# Altium project esp32_controller.PrjPCB
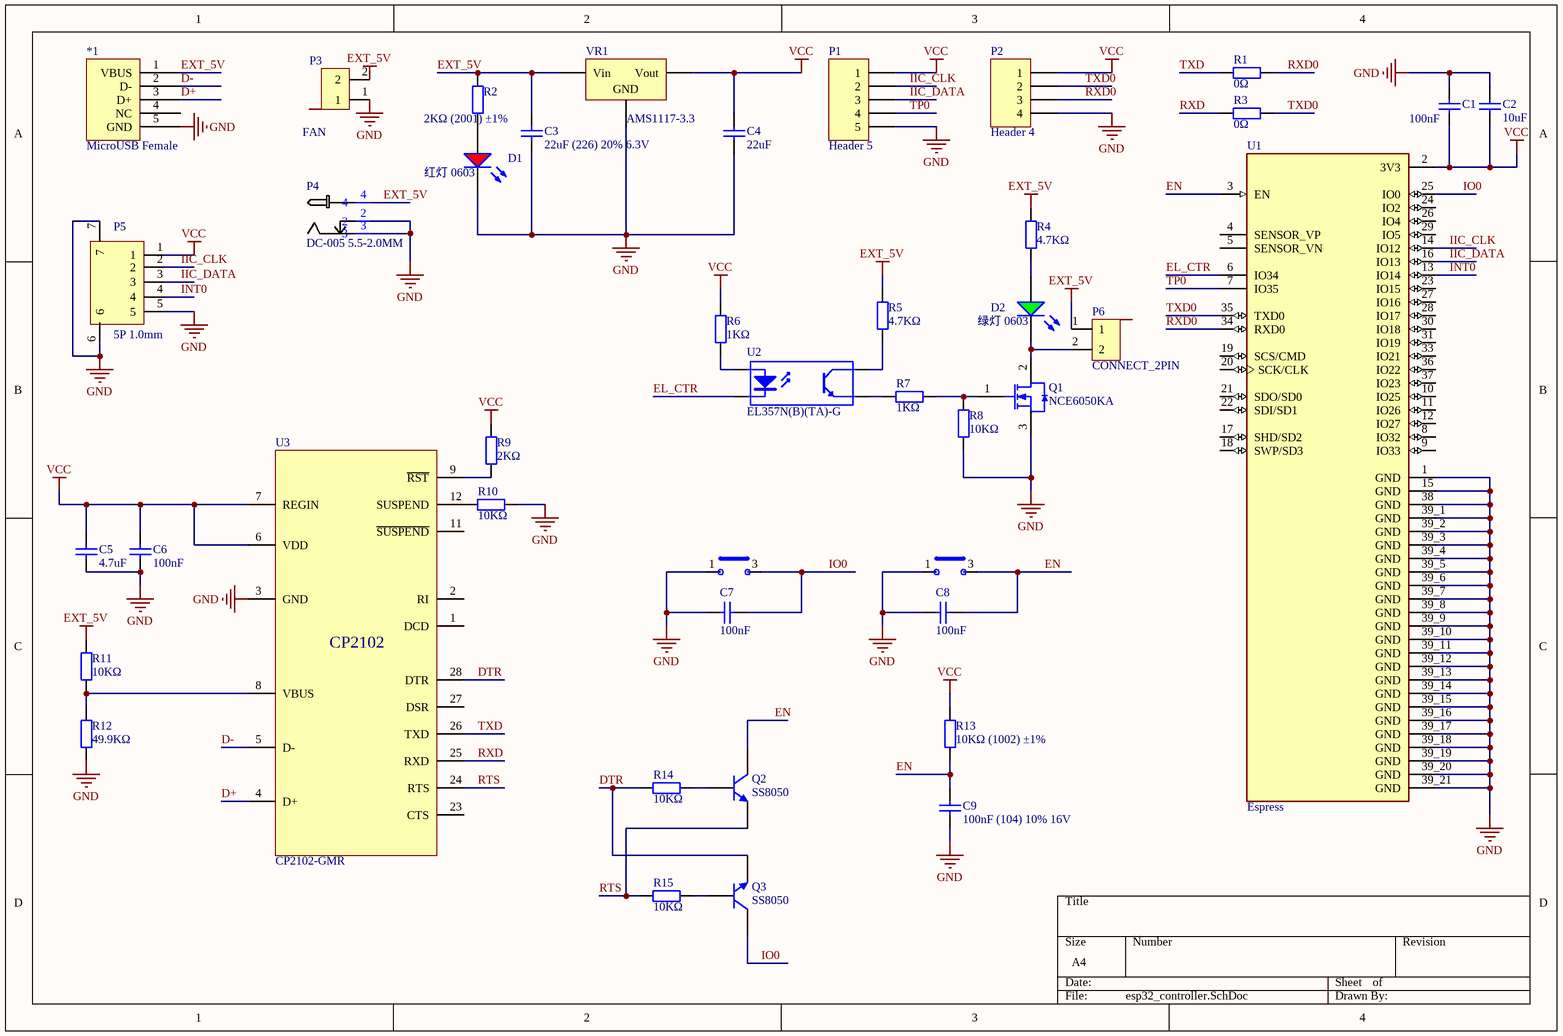
[diagram p0: esp32_controller.SchDoc]
1 sheet, 42 parts. Net scope: global (net labels, ports and power ports of the same name join across sheets).
Board file: esp32_controller.PcbDoc

## Sheet esp32_controller.SchDoc
size A4

### Parts
*1  MicroUSB Female  [MicroUSB Female]
C1  100nF  [0402_C]
C2  10uF  [0603_C]
C3  22uF (226) 20% 6.3V  [0603_C]
C4  22uF  [0603_C]
C5  4.7uF  [0603_C]
C6  100nF  [0603_C]
C7  100nF  [0402_C]
C8  100nF  [0402_C]
C9  100nF (104) 10% 16V  [0402_C]
D1  红灯 0603  [0603_LED_S1]
D2  绿灯 0603  [0603_LED_S1]
P1  Header 5  [HDR1X5]
P2  Header 4  [HDR1X4]
P3  FAN  [CONNECT_2PIN]
P4  DC-005 5.5-2.0MM  [DC-005]
P5  5P 1.0mm  [FPC 1.00MM CONNECTOR SMT]
P6  CONNECT_2PIN  [CONNECT_2PIN]
Q1  NCE6050KA  [TO-252-2]
Q2  SS8050  [SOT-23(SOT-23-3)]
Q3  SS8050  [SOT-23(SOT-23-3)]
R1  0Ω  [0402_R]
R2  2KΩ (2001) ±1%  [0402_R]
R3  0Ω  [0402_R]
R4  4.7KΩ  [0805_R]
R5  4.7KΩ  [0805_R]
R6  1KΩ  [0402_R]
R7  1KΩ  [0805_R]
R8  10KΩ  [0805_R]
R9  2KΩ  [0402_R]
R10  10KΩ  [0402_R]
R11  10KΩ  [0402_R]
R12  49.9KΩ  [0402_R]
R13  10KΩ (1002) ±1%  [0402_R]
R14  10KΩ  [0402_R]
R15  10KΩ  [0402_R]
S1  Tactile Switch 轻触开关  [button]  (value not drawn)
S2  Tactile Switch 轻触开关  [button]  (value not drawn)
U1  Espress  [MODULE_ESP32-WROOM-32D]
U2  EL357N(B)(TA)-G  [SOP-4_P2.54]
U3  CP2102-GMR  [QFN-28_5x5x05P]
VR1  AMS1117-3.3  [SOT-223]

### Nets
EXT_5V: *1.1(VBUS) C3.2 P3.2 P4.4 P6.1 R2.2 R4.2 R5.2 R11.2 VR1.3(Vin)
GND: *1.5(GND) C1.2 C2.2 C3.1 C4.1 C5.1 C6.1 C7.1 C8.1 C9.1 D1.K P1.5 P2.4 P3.1 P4.2 P4.3 P5.5 P5.6 P5.7 Q1.3(S) R8.1 R10.2 R12.1 S1.1 S2.1 U1.1(GND) U1.15(GND) U1.38(GND) U1.39_1(GND) U1.39_2(GND) U1.39_3(GND) U1.39_4(GND) U1.39_5(GND) U1.39_6(GND) U1.39_7(GND) U1.39_8(GND) U1.39_9(GND) U1.39_10(GND) U1.39_11(GND) U1.39_12(GND) U1.39_13(GND) U1.39_14(GND) U1.39_15(GND) U1.39_16(GND) U1.39_17(GND) U1.39_18(GND) U1.39_19(GND) U1.39_20(GND) U1.39_21(GND) U3.3(GND) VR1.1(GND)
VCC: C1.1 C2.1 C4.2 C5.2 C6.2 P1.1 P2.1 P5.1 R6.2 R9.2 R13.2 U1.2(3V3) U3.6(VDD) U3.7(REGIN) VR1.2(Vout)
D+: *1.3(D+) U3.4(D+)
D-: *1.2(D-) U3.5(D-)
DTR: Q3.2(E) R14.1 U3.28(DTR)
EL_CTR: U1.6(IO34) U2.2(K)
EN: C8.2 C9.2 Q2.3(C) R13.1 S2.3 U1.3(EN)
IIC_CLK: P1.2 P5.2 U1.14(IO12)
IIC_DATA: P1.3 P5.3 U1.16(IO13)
INT0: P5.4 U1.13(IO14)
IO0: C7.2 Q3.3(C) S1.3 U1.25(IO0)
RTS: Q2.2(E) R15.1 U3.24(RTS)
RXD: R3.1 U3.25(RXD)
RXD0: P2.3 R1.2 U1.34(RXD0)
TP0: P1.4 U1.7(IO35)
TXD: R1.1 U3.26(TXD)
TXD0: P2.2 R3.2 U1.35(TXD0)
NetD1_A: D1.A R2.1
NetD2_A: D2.A R4.1
NetD2_K: D2.K P6.2 Q1.2(D)
NetQ1_1: Q1.1(G) R7.2 R8.2
NetQ2_1: Q2.1(B) R14.2
NetQ3_1: Q3.1(B) R15.2
NetR5_1: R5.1 U2.4(C)
NetR6_1: R6.1 U2.1(A)
NetR7_1: R7.1 U2.3(E)
NetR9_1: R9.1 U3.9(~{RST})
NetR10_1: R10.1 U3.12(SUSPEND)
NetR11_1: R11.1 R12.2 U3.8(VBUS)

Not connected (* = marked no-connect by the designer): *1 4(NC); U1 4(SENSOR_VP) 5(SENSOR_VN) 8(IO32) 9(IO33) 10(IO25) 11(IO26) 12(IO27) 17(SHD/SD2) 18(SWP/SD3) 19(SCS/CMD) 20(SCK/CLK) 21(SDO/SD0) 22(SDI/SD1) 23(IO15) 24(IO2) 26(IO4) 27(IO16) 28(IO17) 29(IO5) 30(IO18) 31(IO19) 33(IO21) 36(IO22) 37(IO23); U3 1(DCD) 2(RI) 11(~{SUSPEND}) 23(CTS) 27(DSR)

### Notes on the sheet
- (in symbol CP2102-GMR_[C6568]) CP2102

### Library data of the parts
C1 C7-C9 = 0402 100nF (104) 10% 16V: 贴片电容; ComponentLink1Description: 供应商链接; ComponentLink1URL: http://www.szlcsc.com/product/details_1877.html; Package: 0402; Supplier: LC; SuppliersPartNumber: C1525
C2 = 0603 10uF (106) 10% 10V: 贴片电容; ComponentLink1Description: 供应商链接; ComponentLink1URL: http://www.szlcsc.com/product/details_20411.html; Package: 0603; Supplier: LC; SuppliersPartNumber: C19702
C3 C4 = 0603 22uF (226) 20% 6.3V: 贴片电容; ComponentLink1Description: 供应商链接; ComponentLink1URL: http://www.szlcsc.com/product/details_60514.html; Package: 0603; Supplier: LC; SuppliersPartNumber: C59461
C5 = 0603 4.7uF (475) 10% 16V: 贴片电容; ComponentLink1Description: 供应商链接; ComponentLink1URL: http://www.szlcsc.com/product/details_20375.html; Package: 0603; Supplier: LC; SuppliersPartNumber: C19666
C6 = 0603 100nF (104) 10% 50V: 贴片电容; ComponentLink1Description: 供应商链接; ComponentLink1URL: http://www.szlcsc.com/product/details_15331.html; Package: 0603; Supplier: LC; SuppliersPartNumber: C14663
D1 = 0603 红灯: 发光二极管; ComponentLink1Description: 供应商链接; ComponentLink1URL: http://www.szlcsc.com/product/details_2659.html; Package: 0603; Supplier: LC; SuppliersPartNumber: C2286
D2 = 0603 绿灯: 发光二极管; ComponentLink1Description: 供应商链接; ComponentLink1URL: http://www.szlcsc.com/product/details_73152.html; Package: 0603; Supplier: LC; SuppliersPartNumber: C72043
P1 = Header 5: Header, 5-Pin; LatestRevisionDate: 17-Jul-2002; LatestRevisionNote: Re-released for DXP Platform.; Publisher: Altium Limited
P2 = Header 4: Header, 4-Pin; LatestRevisionDate: 17-Jul-2002; LatestRevisionNote: Re-released for DXP Platform.; Publisher: Altium Limited
P3 P6 = CONNECT_2PIN: 欧式接线端子 间距5MM; ComponentLink1Description: 链接; ComponentLink1URL: https://item.szlcsc.com/8969.html
P4 = DC-005 5.5-2.0MM: DC-005 5.5-2.0MM 铁材质; ComponentLink1Description: 立创; ComponentLink1URL: https://item.szlcsc.com/16896.html
P5 = FPC Connect: AFA01-S05FCA-00; ComponentLink1Description: 立创; ComponentLink1URL: https://item.szlcsc.com/254012.html
Q1 = NCE6050KA: MOS(场效应管) N-Channel; ComponentLink1Description: 链接; ComponentLink1URL: https://item.szlcsc.com/97217.html
Q2 Q3 = SOT-23 SS8050 Y1: 三极管; ComponentLink1Description: 供应商链接; ComponentLink1URL: http://www.szlcsc.com/product/details_2507.html; Package: SOT-23; Supplier: LC; SuppliersPartNumber: C2150
R1 R3 = 0402 0Ω (0R0) 1%: 贴片电阻; ComponentLink1Description: 供应商链接; ComponentLink1URL: http://www.szlcsc.com/product/details_17853.html; Package: 0402; Supplier: LC; SuppliersPartNumber: C17168
R2 R9 = 0402 2KΩ (2001) 1%: 贴片电阻; ComponentLink1Description: 供应商链接; ComponentLink1URL: http://www.szlcsc.com/product/details_4516.html; Package: 0402; Supplier: LC; SuppliersPartNumber: C4109
R4 R5 = 0805 4.7KΩ (4701) 1%: 贴片电阻; ComponentLink1Description: 供应商链接; ComponentLink1URL: http://www.szlcsc.com/product/details_18361.html; Package: 0805; Supplier: LC; SuppliersPartNumber: C17673
R6 = 0402 1KΩ (1001) 1%: 贴片电阻; ComponentLink1Description: 供应商链接; ComponentLink1URL: http://www.szlcsc.com/product/details_12256.html; Package: 0402; Supplier: LC; SuppliersPartNumber: C11702
R7 = 0805 1KΩ (1001) 1%: 贴片电阻; ComponentLink1Description: 供应商链接; ComponentLink1URL: http://www.szlcsc.com/product/details_18201.html; Package: 0805; Supplier: LC; SuppliersPartNumber: C17513
R8 = 0805 10KΩ (1002) 1%: 贴片电阻; ComponentLink1Description: 供应商链接; ComponentLink1URL: http://www.szlcsc.com/product/details_18102.html; Package: 0805; Supplier: LC; SuppliersPartNumber: C17414
R10 R11 R13-R15 = 0402 10KΩ (1002) 1%: 贴片电阻; ComponentLink1Description: 供应商链接; ComponentLink1URL: http://www.szlcsc.com/product/details_26487.html; Package: 0402; Supplier: LC; SuppliersPartNumber: C25744
R12 = 0402 49.9KΩ (4992) 1%: 贴片电阻; ComponentLink1Description: 供应商链接; ComponentLink1URL: http://www.szlcsc.com/product/details_26640.html; Package: 0402; Supplier: LC; SuppliersPartNumber: C25897
S1 S2 = Button
U1 = ESP32-WROOM-32D
U2 = EL357N(B)(TA)-G_[C6649]: 贴片光耦; ComponentLink1Description: 供应商链接; ComponentLink1URL: http://www.szlcsc.com/product/details_7114.html; Package: SOP-4_P2.54; Supplier: LC; SuppliersPartNumber: C6649
U3 = CP2102-GMR_[C6568]: USB; ComponentLink1Description: 供应商链接; ComponentLink1URL: http://www.szlcsc.com/product/details_7033.html; Package: QFN-28_5x5x05P; Supplier: LC; SuppliersPartNumber: C6568
VR1 = SOT-223 AMS1117-3.3: 低压差线性稳压(LDO); ComponentLink1Description: 供应商链接; ComponentLink1URL: http://www.szlcsc.com/product/details_6652.html; Package: SOT-223; Supplier: LC; SuppliersPartNumber: C6186